# Altium project Project Power_Supply.PRJPCB
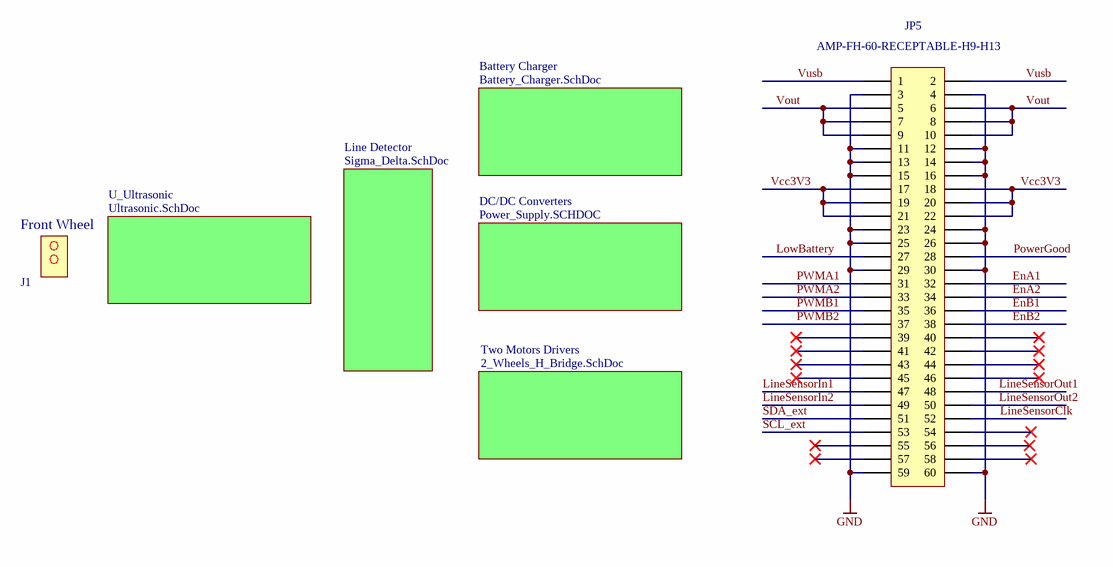
[diagram p0: Gecko3Power.SCHDOC]
6 sheets, 111 parts. Net scope: global (net labels, ports and power ports of the same name join across sheets).
Board files: Gecko3Power.PCBDOC, Gecko3Power_stencil.PCBDOC, Gecko3Power_panel.PCBDOC
Sheets:
  Gecko3Power.SCHDOC
    Two Motors Drivers = 2_Wheels_H_Bridge.SchDoc
    Line Detector = Sigma_Delta.SCHDOC
    U_Ultrasonic = Ultrasonic.SchDoc
    Battery Charger = Battery_Charger.SchDoc
    DC/DC Converters = Power_Supply.SCHDOC

## Sheet Gecko3Power.SCHDOC: Power Supply Board/ Robot Chassis
size A4; ApprovedBy: zac1; Author: mmb1; DrawnBy: mmb1; Engineer: mmb1; Organization: Berne University of Applied Sciences; Address1: School of Engineering and; Address2: Information Technology; Address3: Quellgasse 21; Address4: CH-2501 Biel; Revision: 1.0; SheetNumber: 1; SheetTotal: 6

### Parts
J1  fi  [Roue]  (value not drawn)
JP5  AMP-FH-60-RECEPTABLE-H9-H13  [amp_FH_.8mm_60pin_r_H9_H13]
  CC License  [CC-License]  (value not drawn)

### Sub-sheets
Battery Charger = Battery_Charger.SchDoc: no entries
DC/DC Converters = Power_Supply.SCHDOC: no entries
Line Detector = Sigma_Delta.SchDoc: no entries
Two Motors Drivers = 2_Wheels_H_Bridge.SchDoc: no entries
U_Ultrasonic = Ultrasonic.SchDoc: no entries

### Nets
GND: JP5.3 JP5.4 JP5.11 JP5.12 JP5.13 JP5.14 JP5.15 JP5.16 JP5.23 JP5.24 JP5.25 JP5.26 JP5.29 JP5.30 JP5.59 JP5.60
EnA1: JP5.32
EnA2: JP5.34
EnB1: JP5.36
EnB2: JP5.38
LineSensorClk: JP5.52
LineSensorIn1: JP5.47
LineSensorIn2: JP5.49
LineSensorOut1: JP5.48
LineSensorOut2: JP5.50
LowBattery: JP5.27
PowerGood: JP5.28
PWMA1: JP5.31
PWMA2: JP5.33
PWMB1: JP5.35
PWMB2: JP5.37
SCL_ext: JP5.53
SDA_ext: JP5.51
Vcc3V3: JP5.17 JP5.18 JP5.19 JP5.20 JP5.21 JP5.22
Vout: JP5.5 JP5.6 JP5.7 JP5.8 JP5.9 JP5.10
Vusb: JP5.1 JP5.2

Not connected (* = marked no-connect by the designer): JP5 39* 40* 41* 42* 43* 44* 45* 46* 54* 55* 56* 57* 58*

### Notes on the sheet
- Title:
- Size:
- Date:
- A4_L
- Author:
- Time:
- Revision:
- Sheet
- of
- File:
- (in symbol ROUE) Front Wheel

### Library data of the parts
J1 = ROUE
JP5 = AMP-FH-60-RECEPTABLE-H9-H13: AMP Free Height System, 0.8mm, 60 Pin, 9 or 13mm Height, Receptable; Part Number: 5-5179010-2; Value: fh-60r-13mm; Currency: CHF; Packaging unit: 1; Distributor: Farnell; Distributor Number: 1098 357; Manufacturer: AMP; RoHS: yes; Price: 3.85

## Sheet 2_Wheels_H_Bridge.SchDoc: H Bridge
size A4; ApprovedBy: zac1; Author: mmb1; DrawnBy: mmb1; Engineer: mmb1; Organization: Berne University of Applied Sciences; Address1: School of Engineering and; Address2: Information Technology; Address3: Quellgasse 21; Address4: CH-2501 Biel; Revision: 1.0; SheetNumber: 4; SheetTotal: 6
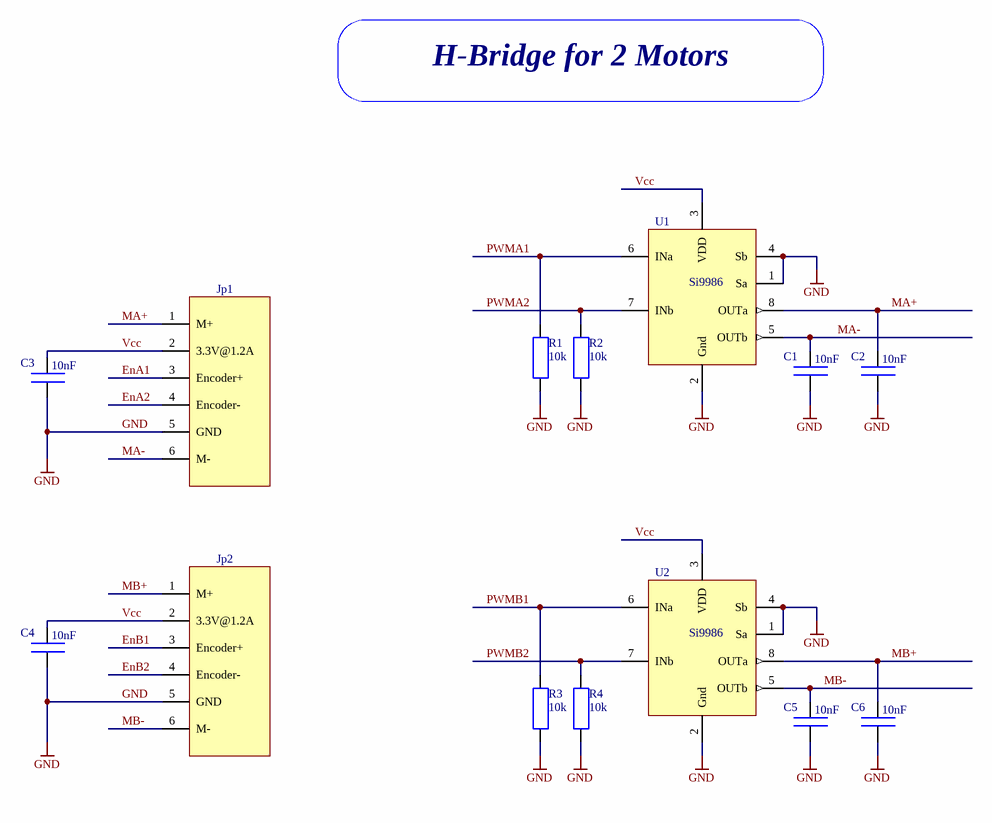
[diagram p1: 2_Wheels_H_Bridge.SchDoc]

### Parts
C1  10nF  [1608[0603]]
C2  10nF  [1608[0603]]
C3  10nF  [1608[0603]]
C4  10nF  [1608[0603]]
C5  10nF  [1608[0603]]
C6  10nF  [1608[0603]]
Jp1  (no value)  [New connector]
Jp2  (no value)  [New connector]
R1  10k  [1608[0603]]
R2  10k  [1608[0603]]
R3  10k  [1608[0603]]
R4  10k  [1608[0603]]
U1  Si9986  [Si9986]
U2  Si9986  [Si9986]

### Nets
GND: C1.1(J1) C2.1(J1) C3.1(J1) C4.1(J1) C5.1(J1) C6.1(J1) Jp1.5(GND) Jp2.5(GND) R1.1(J1) R2.1(J1) R3.1(J1) R4.1(J1) U1.1(Sa) U1.2(Gnd) U1.4(Sb) U2.1(Sa) U2.2(Gnd) U2.4(Sb)
EnA1: Jp1.3(Encoder+)
EnA2: Jp1.4(Encoder-)
EnB1: Jp2.3(Encoder+)
EnB2: Jp2.4(Encoder-)
MA+: C2.2(J2) Jp1.1(M+) U1.8(OUTa)
MA-: C1.2(J2) Jp1.6(M-) U1.5(OUTb)
MB+: C6.2(J2) Jp2.1(M+) U2.8(OUTa)
MB-: C5.2(J2) Jp2.6(M-) U2.5(OUTb)
PWMA1: R1.2(J2) U1.6(INa)
PWMA2: R2.2(J2) U1.7(INb)
PWMB1: R3.2(J2) U2.6(INa)
PWMB2: R4.2(J2) U2.7(INb)
Vcc: C3.2(J2) C4.2(J2) Jp1.2(3.3V@1.2A) Jp2.2(3.3V@1.2A) U1.3(VDD) U2.3(VDD)

### Notes on the sheet
- H-Bridge for 2 Motors
- Title:
- Size:
- Date:
- A4_L
- Author:
- Time:
- Revision:
- Sheet
- of
- File:

### Library data of the parts
C1-C6 = CAP: Capacitor; Manufacturer: AVX; Part Number: 06035C103KAT2A; Value: 10nF 0603; Currency: CHF; Packaging unit: 10; Part Type: 10nF; Distributor: Farnell; Distributor Number: 1327 675; Price: 0.07; RoHS: yes
Jp1 Jp2 = NEW CONNECTOR: Manufacturer: AMP; Part Number: 1241050-3; Value: Header 2x3,smt; Currency: CHF; Packaging unit: 1; Distributor: Farnell; Distributor Number: 9689 567; RoHS: yes; Price: 1.5
R1-R4 = RES: Resistance; Manufacturer: Multicomp; Part Number: MC 0.063W 0603 1% 10K; Value: 10k 0603; Currency: CHF; Packaging unit: 50; Part Type: 10k; Distributor: Farnell; Distributor Number: 9330 399; RoHS: X-yes; Price: 0.062
U1 U2 = Si9986: Manufacturer: Vishay; Part Number: SI9986DY-T1-E3; Currency: CHF; lead time: 2 Weeks; Packaging unit: 1; Value: Si9986; Distributor: Farnell; Distributor Number: 1199 224; RoHS: yes; Price: 6.6

## Sheet Sigma_Delta.SCHDOC: Line Detector Module (Sigma_Delta)
size A4; ApprovedBy: zac1; Author: mmb1; DrawnBy: mmb1; Engineer: mmb1; Organization: Berne University of Applied Sciences; Address1: School of Engineering and; Address2: Information Technology; Address3: Quellgasse 21; Address4: CH-2501 Biel; Revision: 1.0; SheetNumber: 5; SheetTotal: 6
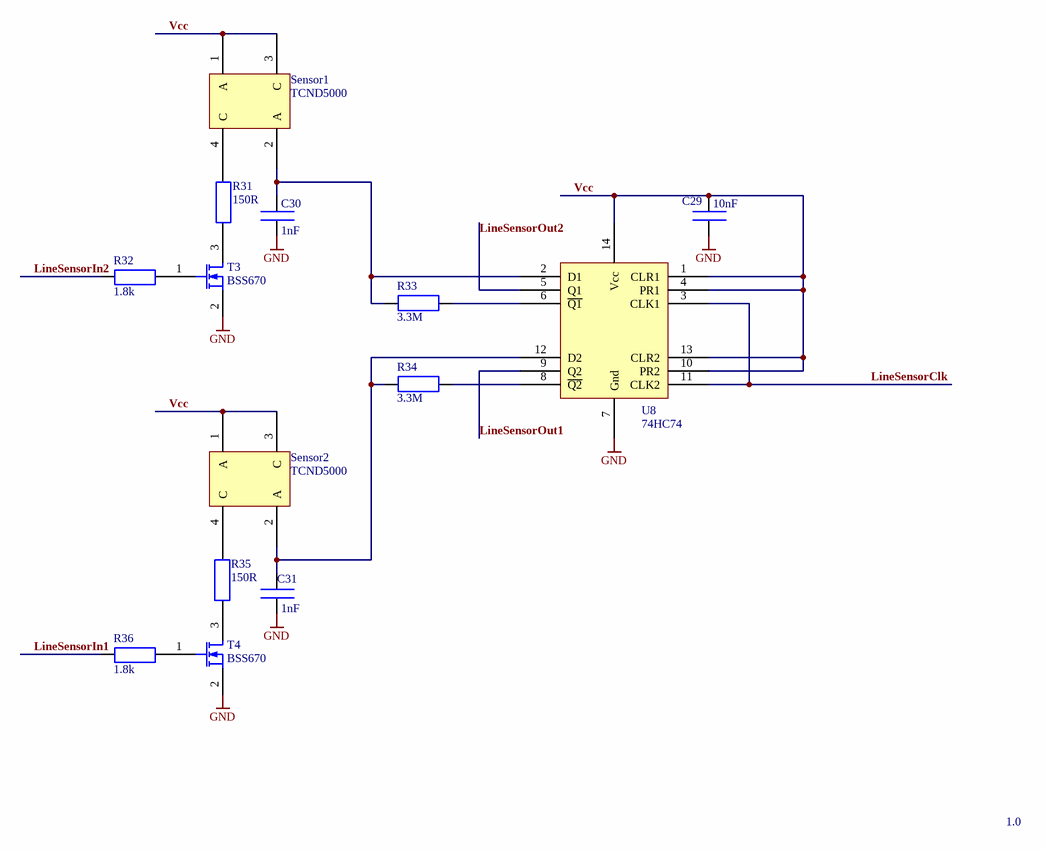
[diagram p2: Sigma_Delta.SCHDOC]

### Parts
C29  10nF  [1608[0603]]
C30  1nF  [1608[0603]]
C31  1nF  [1608[0603]]
R31  150R  [1608[0603]]
R32  1.8k  [1608[0603]]
R33  3.3M  [1608[0603]]
R34  3.3M  [1608[0603]]
R35  150R  [1608[0603]]
R36  1.8k  [1608[0603]]
Sensor1  TCND5000  [TCND5000]
Sensor2  TCND5000  [TCND5000]
T3  BSS670  [SOT-23]
T4  BSS670  [SOT-23]
U8  74HC74  [SO-G14]

### Nets
GND: C29.1(J1) C30.1(J1) C31.1(J1) T3.2(S) T4.2(S) U8.7(Gnd)
LineSensorClk: U8.3(CLK1) U8.11(CLK2)
LineSensorIn1: R36.1(J1)
LineSensorIn2: R32.1(J1)
LineSensorOut1: U8.9(Q2)
LineSensorOut2: U8.5(Q1)
Vcc: C29.2(J2) Sensor1.1(A) Sensor1.3(C) Sensor2.1(A) Sensor2.3(C) U8.1(CLR1) U8.4(PR1) U8.10(PR2) U8.13(CLR2) U8.14(Vcc)
NetC30_2: C30.2(J2) R33.2(J2) Sensor1.2(A) U8.2(D1)
NetC31_2: C31.2(J2) R34.2(J2) Sensor2.2(A) U8.12(D2)
NetR31_1: R31.1(J1) T3.3(D)
NetR31_2: R31.2(J2) Sensor1.4(C)
NetR32_2: R32.2(J2) T3.1(G)
NetR33_1: R33.1(J1) U8.6(~{Q1})
NetR34_1: R34.1(J1) U8.8(~{Q2})
NetR35_1: R35.1(J1) Sensor2.4(C)
NetR35_2: R35.2(J2) T4.3(D)
NetR36_2: R36.2(J2) T4.1(G)

### Notes on the sheet
- 1.0
- Title:
- Size:
- Date:
- A4_L
- Author:
- Time:
- Revision:
- Sheet
- of
- File:

### Library data of the parts
C29 = CAP: as C1 on sheet 2_Wheels_H_Bridge; Part Type: 10nF; Distributor: Farnell; Distributor Number: 1327 675; Price: 0.07; RoHS: yes
C30 C31 = CAP: Capacitor; Manufacturer: Murata; Part Number: GRM188R71H102KA01D; Value: 1nF 0603; Currency: CHF; Packaging unit: 10; Part Type: 1nF; Distributor: Farnell; Distributor Number: 8819 955; Price: 0.071; RoHS: yes
R31 R35 = RES: Resistance; Manufacturer: Multicomp; Part Number: MC 0.063W 0603 1% 150R; Value: 150R 0603; Currency: CHF; Packaging unit: 50; Part Type: 150R; Distributor: Farnell; Distributor Number: 9330 593; RoHS: X-yes; Price: 0.062
R32 R36 = RES: Resistance; Manufacturer: Multicomp; Part Number: MC 0.063W 0603 1% 1K8; Value: 1.8k 0603; Currency: CHF; Packaging unit: 50; Part Type: 1.8k; Distributor: Farnell; Distributor Number: 9330 712; Price: 0.062; RoHS: X-yes
R33 R34 = RES: Resistance; Manufacturer: PHYCOMP; Part Number: 232270463305; Value: 3.3M 0603; Currency: CHF; Packaging unit: 50; Part Type: 3.3M; Distributor: Farnell; Distributor Number: 9238 905; RoHS: yes; Price: 0.122
Sensor1 Sensor2 = TCND5000: Manufacturer: Vishay; Currency: CHF; lead time: 2 Weeks; Packaging unit: 1; Value: TCND5000; Distributor: Farnell; Distributor Number: 9169 997; Part Number: TCND5000; RoHS: yes; Price: 3.3
T3 T4 = MOSFET-N: Manufacturer: Infineon; Part Number: BSS670S2L; Currency: CHF; Packaging unit: 5; Value: BSS670; Distributor: Farnell; Distributor Number: 1095 673; Price: 0.35; RoHS: yes
U8 = 74HC74: Manufacturer: TI; Part Number: SN74HC74D; Value: 74HC74D; Currency: CHF; Packaging unit: 1; Distributor: Farnell; Distributor Number: 9591 680; RoHS: yes; Price: 0.632

## Sheet Ultrasonic.SchDoc: Ultrasonic Sensor
size A4; ApprovedBy: zac1; Author: mmb1; DrawnBy: mmb1; Engineer: mmb1; Organization: Berne University of Applied Sciences; Address1: School of Engineering and; Address2: Information Technology; Address3: Quellgasse 21; Address4: CH-2501 Biel; Revision: 1.0; SheetNumber: 6; SheetTotal: 6
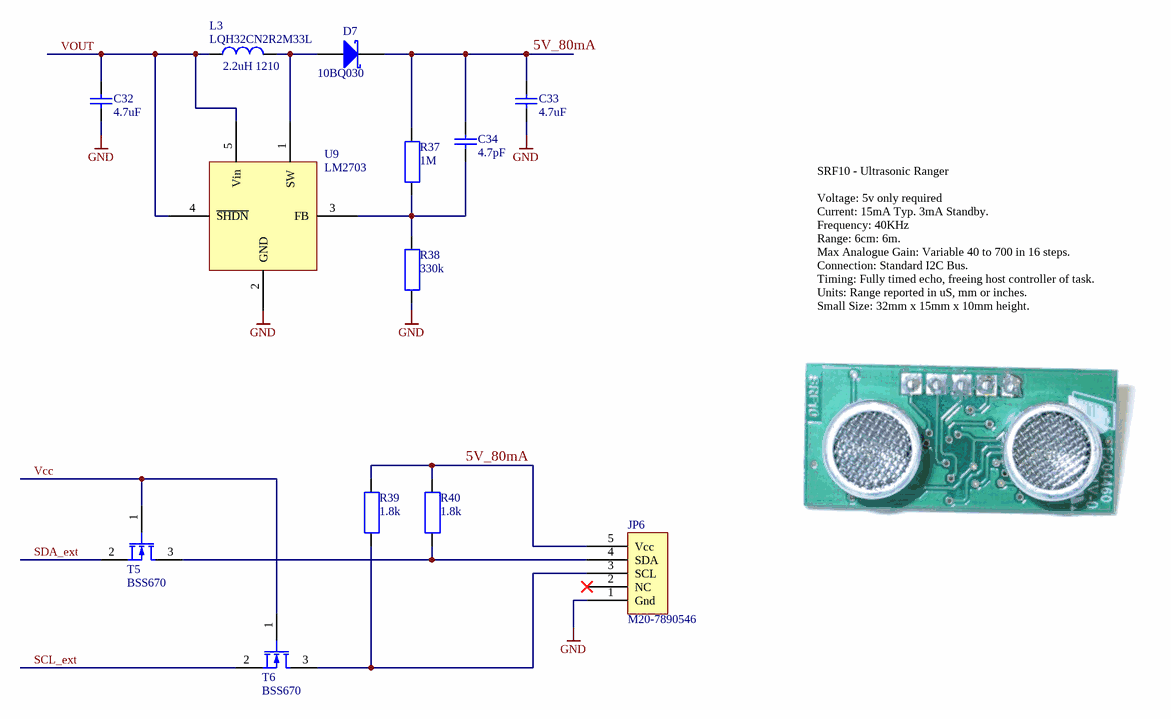
[diagram p3: Ultrasonic.SchDoc]

### Parts
C32  4.7uF  [C0805]
C33  4.7uF  [C0805]
C34  4.7pF  [C0805]
D7  10BQ030  [MBRS1100T3-D]
JP6  M20-7890546  [M20-7890546]
L3  value 2.2uH 1210  [CAPC1210L]  (hidden comment: LQH32CN2R2M33L)
R37  1M  [1608[0603]]
R38  330k  [1608[0603]]
R39  1.8k  [1608[0603]]
R40  1.8k  [1608[0603]]
T5  BSS670  [SOT-23]
T6  BSS670  [SOT-23]
U9  LM2703  [LM2703]

### Nets
GND: C32.1 C33.1 JP6.1(Gnd) R38.1(J1) U9.2(GND)
5V_80mA: C33.2 C34.2 D7.2(K) JP6.5(Vcc) R37.2(J2) R39.2(J2) R40.2(J2)
SCL_ext: T6.2(S)
SDA_ext: T5.2(S)
Vcc: T5.1(G) T6.1(G)
Vout: C32.2 L3.1(J1) U9.4(~{SHDN}) U9.5(Vin)
NetC34_1: C34.1 R37.1(J1) R38.2(J2) U9.3(FB)
NetD7_1: D7.1(A) L3.2(J2) U9.1(SW)
NetJP6_3: JP6.3(SCL) R39.1(J1) T6.3(D)
NetJP6_4: JP6.4(SDA) R40.1(J1) T5.3(D)

Not connected (* = marked no-connect by the designer): JP6 2(NC)*

### Notes on the sheet
- SRF10 - Ultrasonic Ranger
  Voltage: 5v only required
  Current: 15mA Typ. 3mA Standby.
  Frequency: 40KHz
  Range: 6cm: 6m.
  Max Analogue Gain: Variable 40 to 700 in 16 steps.
  Connection: Standard I2C Bus.
  Timing: Fully timed echo, freeing host controller of task.
  Units: Range reported in uS, mm or inches.
  Small Size: 32mm x 15mm x 10mm height.
- Title:
- Size:
- Date:
- A4_L
- Author:
- Time:
- Revision:
- Sheet
- of
- File:

### Library data of the parts
C32 C33 = Cap: Capacitor; Manufacturer: Kemet; Part Number: C0805C475K4PAC; Currency: CHF; Packaging unit: 10; Published: 8-Jun-2000; LatestRevisionDate: 17-Jul-2002; LatestRevisionNote: Re-released for DXP Platform.; Publisher: Altium Limited; Value: 4.7uF; Distributor: Farnell; Distributor Number: 9227 849; Price: 0.508; RoHS: yes
C34 = Cap: Capacitor; Manufacturer: AVX; Part Number: 06032U4R7CAT2A; Value: 4.7pF 0603; Currency: CHF; Packaging unit: 5; Published: 8-Jun-2000; LatestRevisionDate: 17-Jul-2002; LatestRevisionNote: Re-released for DXP Platform.; Publisher: Altium Limited; Distributor: Farnell; Distributor Number: 7568 258; Price: 0.45; RoHS: yes
D7 = D Schottky: Schottky Diode; Manufacturer: Vishay; Part Number: 10BQ030PBF; Currency: CHF; Packaging unit: 1; Value: 10BQ030; Distributor: Farnell; Distributor Number: 9100 687; Price: 0.42; RoHS: yes
JP6 = M20-7890546: Manufacturer: HARWIN; Currency: CHF; Packaging unit: 10; Value: M20-7890546; Distributor: Farnell; Distributor Number: 7992 076; Part Number: M20-7890546; RoHS: yes; Price: 1.45
L3 = COIL-LQH: Inductance; Manufacturer: Murata; Currency: CHF; Packaging unit: 5; Part Type: LQH32CN2R2M33L; Distributor: Farnell; Distributor Number: 9522 182; Part Number: LQH32CN2R2M33L; RoHS: yes; Price: 0.357
R37 = RES: Resistance; Manufacturer: Multicomp; Part Number: MC 0.063W 0603 1% 1M; Value: 1M 0603; Currency: CHF; Packaging unit: 50; Part Type: 1M; Distributor: Farnell; Distributor Number: 9330 410; RoHS: X-yes; Price: 0.062
R38 = RES: Resistance; Manufacturer: Multicomp; Part Number: MC 0.063W 0603 1% 330K; Value: 330k 0603; Currency: CHF; Packaging unit: 50; Part Type: 330k; Distributor: Farnell; Distributor Number: 9331 042; RoHS: X-yes; Price: 0.062
R39 R40 = RES: as R32 on sheet Sigma_Delta; Part Type: 1.8k; Distributor: Farnell; Distributor Number: 9330 712; RoHS: X-yes; Price: 0.062
T5 T6 = MOSFET-N: as T3 on sheet Sigma_Delta; Value: BSS670; Distributor: Farnell; Distributor Number: 1095 673; Price: 0.35; RoHS: yes
U9 = LM2703: Manufacturer: National; Part Number: LM2703MF-ADJ; Currency: CHF; Packaging unit: 1; Part Type: LM2703; Value: LM2703; Distributor: Farnell; Distributor Number: 9779 442; RoHS: yes; Price: 4

## Sheet Battery_Charger.SchDoc: Battery Charger
size A4; Author: zac1; DrawnBy: zac1; Engineer: zac1; Organization: Berne University of Applied Sciences; Address1: School of Engineering and; Address2: Information Technology; Address3: Quellgasse 21; Address4: CH-2501 Biel; Revision: 1.0; SheetNumber: 2; SheetTotal: 6
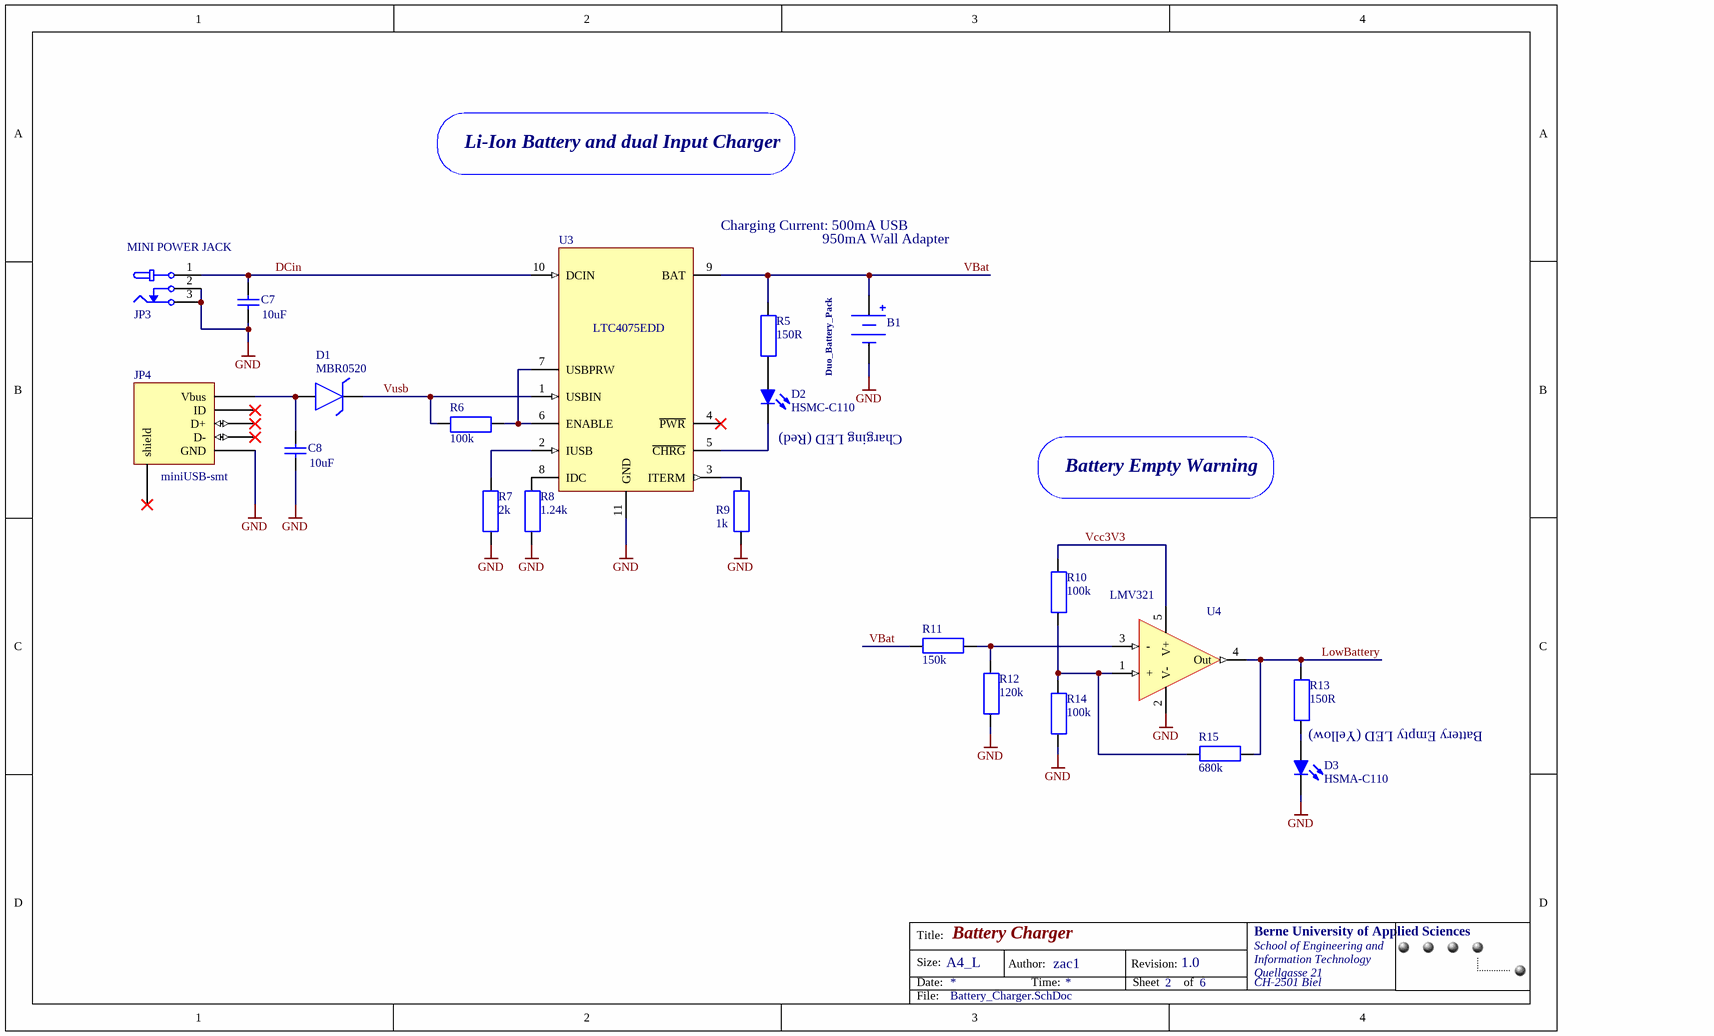
[diagram p4: Battery_Charger.SchDoc]

### Parts
B1  New_Battery  [Battery_new]  (value not drawn)
C7  value 10uF  [C1206]  (hidden comment: Cap Semi)
C8  value 10uF  [C1206]  (hidden comment: Cap Semi)
D1  MBR0520  [sod-123]
D2  HSMC-C110  [HSMC-C110]
D3  HSMA-C110  [HSMC-C110]
JP3  MINI POWER JACK  [Mini power Jack]
JP4  value miniUSB-smt  [USB_MINI_B_SMD]  (hidden comment: USB-MINIB-SMT)
R5  150R  [1608[0603]]
R6  100k  [1608[0603]]
R7  2k  [1608[0603]]
R8  1.24k  [1608[0603]]
R9  1k  [1608[0603]]
R10  100k  [1608[0603]]
R11  150k  [1608[0603]]
R12  120k  [1608[0603]]
R13  150R  [1608[0603]]
R14  100k  [1608[0603]]
R15  680k  [1608[0603]]
U3  LTC4075EDD  [LTC4075]
U4  LMV321  [LMV331]

### Nets
GND: B1.2(J2) C7.1 C8.1 D3.1(K) JP3.2(GND) JP3.3(GND) JP4.GND R7.2(J2) R8.1(J1) R9.1(J1) R12.1(J1) R14.1(J1) U3.11(GND) U4.2(V-)
DCin: C7.2 JP3.1(VDD) U3.10(DCIN)
LowBattery: R13.2(J2) R15.1(J1) U4.4(Out)
VBat: B1.1(J1) R5.2(J2) R11.2(J2) U3.9(BAT)
Vcc3V3: R10.2(J2) U4.5(V+)
Vusb: D1.1(Cathode) R6.1(J1) U3.1(USBIN)
NetC8_2: C8.2 D1.2(Anode) JP4.Vbus
NetD2_1: D2.1(K) U3.5(~{CHRG})
NetD2_2: D2.2(A) R5.1(J1)
NetD3_2: D3.2(A) R13.1(J1)
NetR6_2: R6.2(J2) U3.6(ENABLE) U3.7(USBPRW)
NetR7_1: R7.1(J1) U3.2(IUSB)
NetR8_2: R8.2(J2) U3.8(IDC)
NetR9_2: R9.2(J2) U3.3(ITERM)
NetR10_1: R10.1(J1) R14.2(J2) R15.2(J2) U4.1(+)
NetR11_1: R11.1(J1) R12.2(J2) U4.3(-)

Not connected (* = marked no-connect by the designer): JP4 D+* D-* ID* shield*; U3 4(~{PWR})*

### Notes on the sheet
- Li-Ion Battery and dual Input Charger
- (near U3) Charging Current: 500mA USB
- 950mA Wall Adapter
- (near B1) Duo_Battery_Pack
- (near D2) Charging LED (Red)
- Battery Empty Warning
- (near R13) Battery Empty LED (Yellow)
- Title:
- Size:
- Date:
- A4_L
- Author:
- Time:
- Revision:
- Sheet
- of
- File:

### Library data of the parts
B1 = BATTERY_NEW: Manufacturer: Contrel; Value: PA-LP987; Currency: CHF; lead time: 5 Weeks; Packaging unit: 1; Distributor: Contrel; Distributor Number: PA-LP987; Part Number: PA-LP987; RoHS: yes
C7 C8 = Cap Semi: Capacitor (Semiconductor SIM Model); Manufacturer: Murata; Part Number: GRM31CR70J106KA01L; Currency: CHF; Packaging unit: 1; Published: 8-Jun-2000; LatestRevisionDate: 17-Jul-2002; LatestRevisionNote: Re-released for DXP Platform.; Publisher: Altium Limited; Distributor: Farnell; Distributor Number: 9527 729; Price: 0.25; RoHS: yes
D1 = SCHOTTKY_MBR05*: Manufacturer: ON Semi; Part Number: MBR0520LT1G; Currency: CHF; Packaging unit: 1; Part Type: MBR0520; Value: MBR0520; Distributor: Farnell; Distributor Number: 9556 915; Price: 0.561; RoHS: yes
D2 = LED-HSM*-C110: LED; Manufacturer: Avago; Value: side led red; Currency: CHF; Packaging unit: 5; Revision: July-2002: Re-released for DXP Platform.; Part Type: HSMC-C110; Distributor: Farnell; Distributor Number: 8554 498; Part Number: HSMC-C110; Price: 0.288; RoHS: yes
D3 = LED-HSM*-C110: LED; Manufacturer: Avago; Value: side led yellow; Currency: CHF; Packaging unit: 5; Revision: July-2002: Re-released for DXP Platform.; Part Type: HSMA-C110; Distributor: Farnell; Distributor Number: 8554 455; Part Number: HSMA-C110; Price: 0.577; RoHS: yes
JP3 = MINI POWER JACK: Manufacturer: CLIFF ELECTRONIC; Value: DC8; Currency: CHF; Packaging unit: 10; Distributor: Farnell; Distributor Number: 224 947; Part Number: DC8; RoHS: yes; Price: 1.855
JP4 = USB-MINIB-SMT: Manufacturer: Lumberg; Part Number: 2486 01; Currency: CHF; Packaging unit: 1; Distributor: Farnell; Distributor Number: 1243 250; RoHS: yes; Price: 2.55
R5 R13 = RES: as R31 on sheet Sigma_Delta; Part Type: 150R; Distributor: Farnell; Distributor Number: 9330 593; RoHS: X-yes; Price: 0.062
R6 R10 R14 = RES: Resistance; Manufacturer: Multicomp; Part Number: MC 0.063W 0603 1% 100K; Value: 100k 0603; Currency: CHF; Packaging unit: 50; Part Type: 100k; Distributor: Farnell; Distributor Number: 9330 402; RoHS: X-yes; Price: 0.062
R7 = RES: Resistance; Manufacturer: Multicomp; Part Number: MC 0.063W 0603 1% 2K; Value: 2k 0603; Currency: CHF; Packaging unit: 50; Part Type: 2k; Distributor: Farnell; Distributor Number: 9330 763; RoHS: X-yes; Price: 0.062
R8 = RES: as R37 on sheet Ultrasonic; Part Type: 1.24k; Distributor: Farnell; Distributor Number: 9330 410; RoHS: X-yes; Price: 0.062
R9 = RES: Resistance; Manufacturer: Multicomp; Part Number: MC 0.063W 0603 1% 1K; Value: 1k 0603; Currency: CHF; Packaging unit: 50; Part Type: 1k; Distributor: Farnell; Distributor Number: 9330 380; RoHS: X-yes; Price: 0.062
R11 = RES: Resistance; Manufacturer: Multicomp; Part Number: MC 0.063W 0603 1% 150K; Value: 150k 0603; Currency: CHF; Packaging unit: 50; Part Type: 150k; Distributor: Farnell; Distributor Number: 9330 623; RoHS: X-yes; Price: 0.034
R12 = RES: Resistance; Manufacturer: Multicomp; Part Number: MC 0.063W 0603 1% 120K; Value: 120k 0603; Currency: CHF; Packaging unit: 50; Part Type: 120k; Distributor: Farnell; Distributor Number: 9330 526; RoHS: X-yes; Price: 0.062
R15 = RES: Resistance; Manufacturer: Multicomp; Part Number: MC 0.063W 0603 1% 680K; Value: 680k 0603; Currency: CHF; Packaging unit: 50; Part Type: 680k; Distributor: Farnell; Distributor Number: 9331 476; RoHS: X-yes; Price: 0.062
U3 = LTC4075: Manufacturer: Linear; Part Number: LTC4075EDD#PBF; Currency: $; lead time: 2 Weeks; Packaging unit: 1; Value: LTC4075; Distributor: Linear online; Distributor Number: LTC4075EDD#PBF; RoHS: yes; Price: 2.67
U4 = LMV321: Op. Amp.; Manufacturer: TI; Value: LMV321IDBVR; Currency: CHF; Packaging unit: 1; Distributor: Farnell; Distributor Number: 1105 935; Part Number: LMV321IDBVR; RoHS: yes; Price: 0.863

## Sheet Power_Supply.SCHDOC: Power Supply
size A3; ApprovedBy: zac1; Author: mmb1; DrawnBy: mmb1; Engineer: mmb1; Organization: Berne University of Applied Sciences; Address1: School of Engineering and; Address2: Information Technology; Address3: Quellgasse 21; Address4: CH-2501 Biel; Revision: 1.0; SheetNumber: 3; SheetTotal: 6
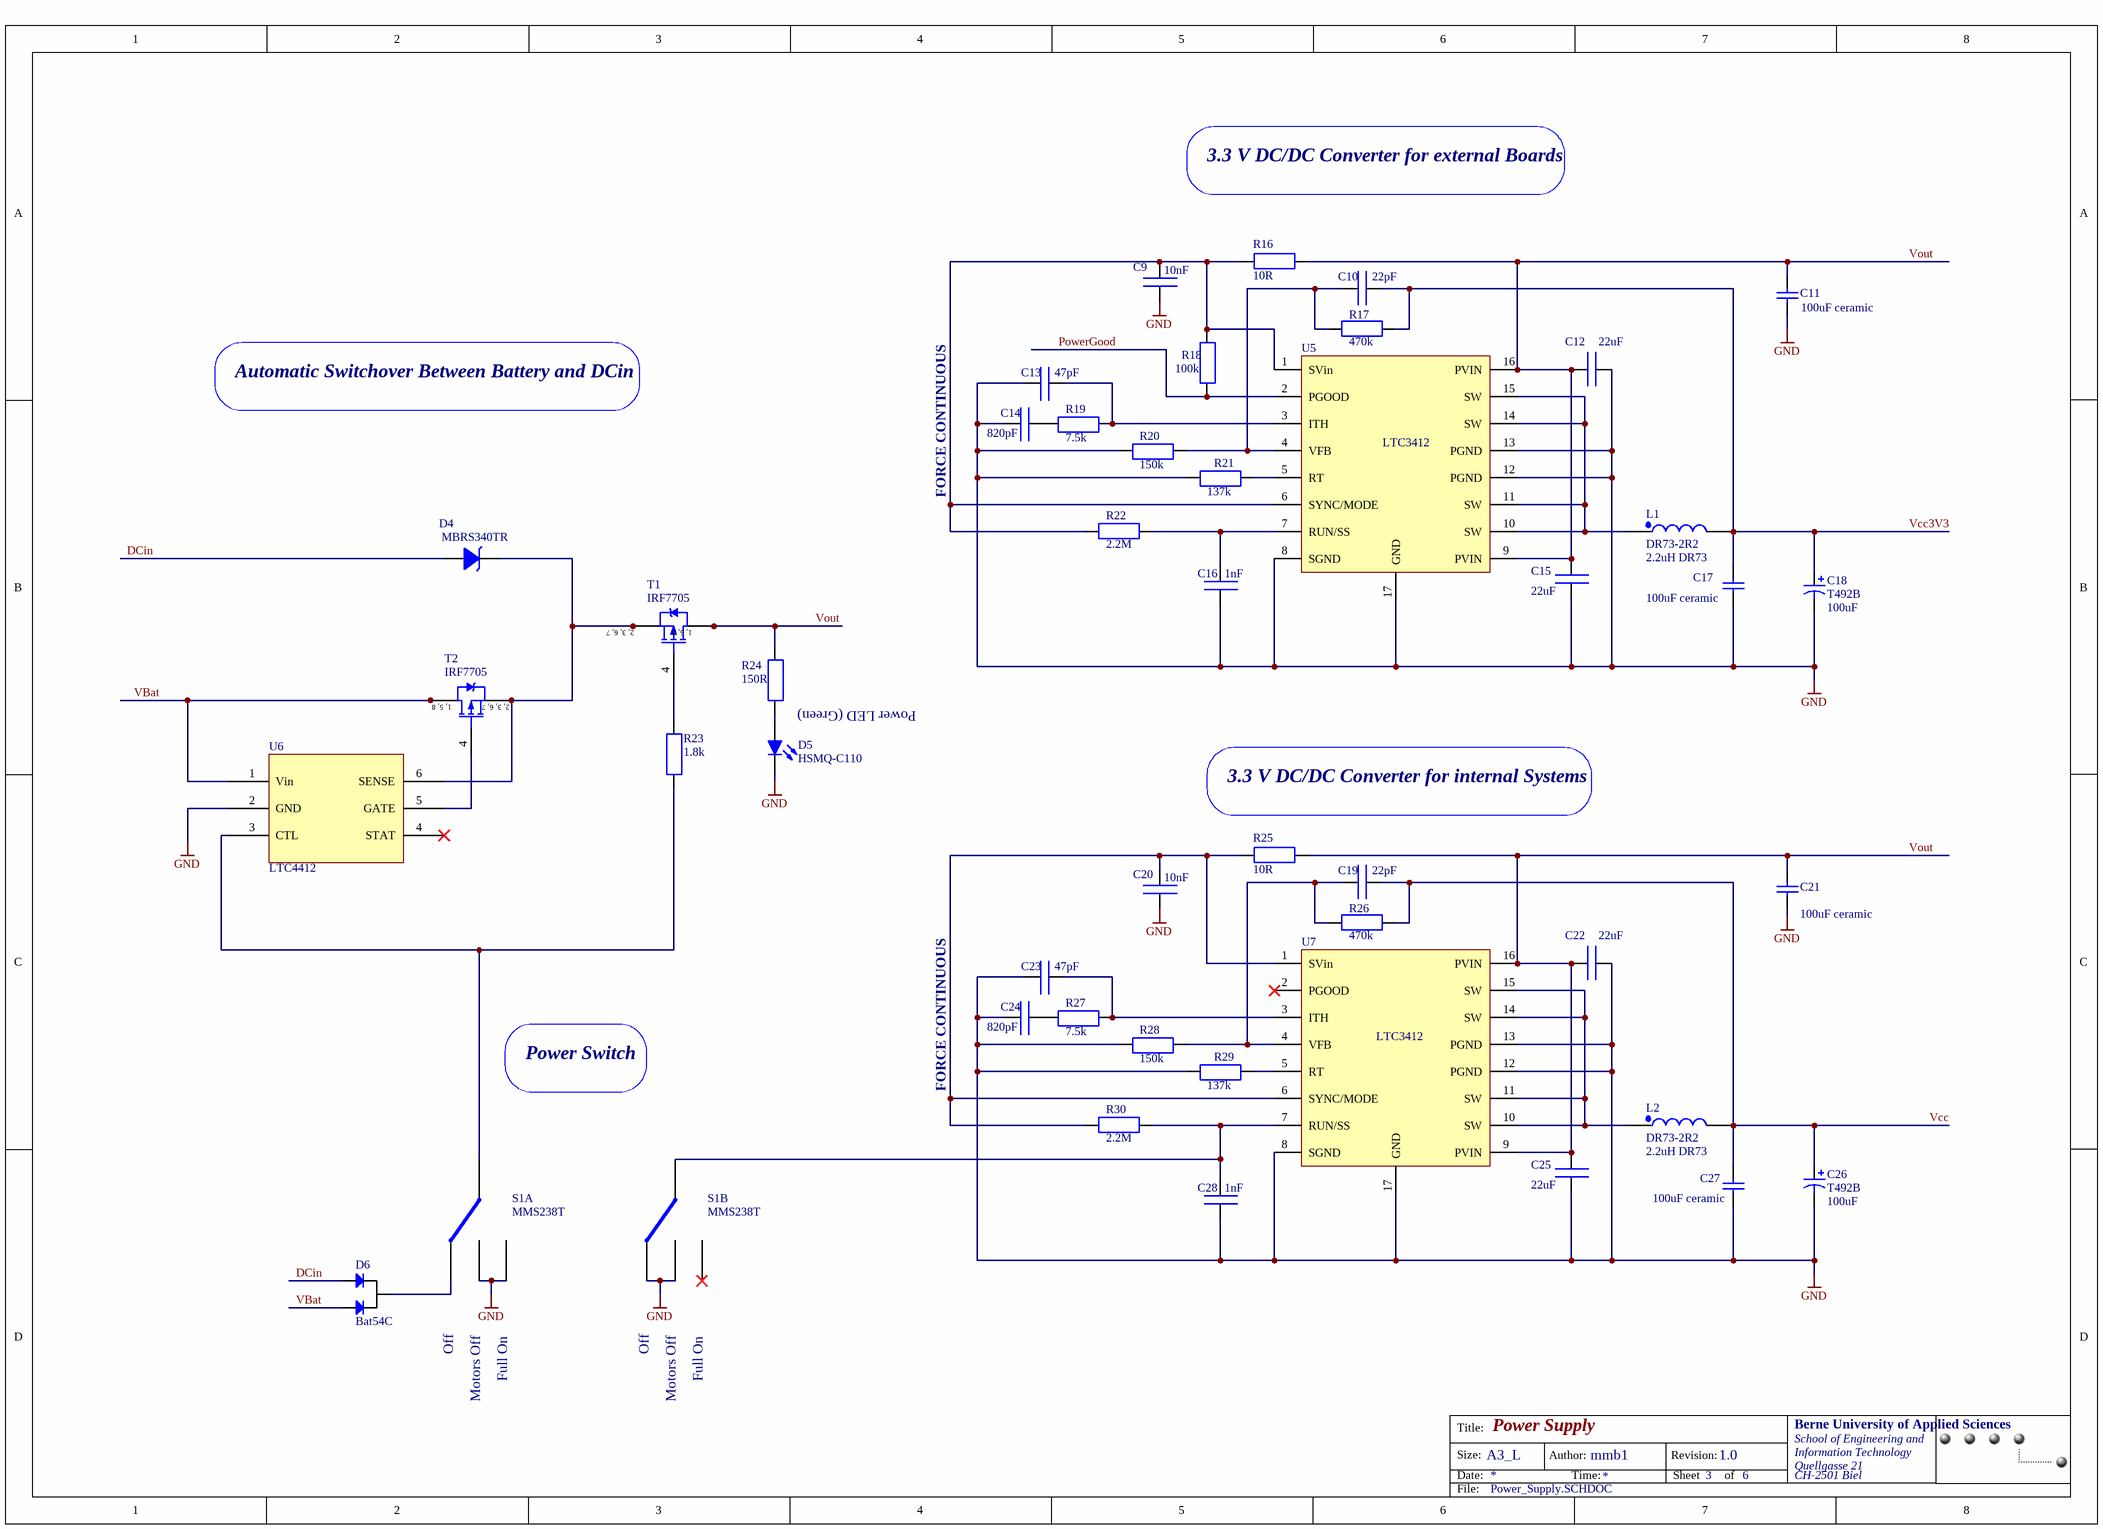
[diagram p5: Power_Supply.SCHDOC]

### Parts
C9  10nF  [1608[0603]]
C10  22pF  [1608[0603]]
C11  value 100uF ceramic  [C1210]  (hidden comment: Cap Semi)
C12  22uF  [C0805]
C13  47pF  [1608[0603]]
C14  820pF  [1608[0603]]
C15  22uF  [C0805]
C16  1nF  [1608[0603]]
C17  value 100uF ceramic  [C1210]  (hidden comment: Cap Semi)
C18  T492B  value 100uF  [B]
C19  22pF  [1608[0603]]
C20  10nF  [1608[0603]]
C21  value 100uF ceramic  [C1210]  (hidden comment: Cap Semi)
C22  22uF  [C0805]
C23  47pF  [1608[0603]]
C24  820pF  [1608[0603]]
C25  22uF  [C0805]
C26  T492B  value 100uF  [B]
C27  value 100uF ceramic  [C1210]  (hidden comment: Cap Semi)
C28  1nF  [1608[0603]]
D4  value MBRS340TR  [MBRS340]  (hidden comment: Schottky  Power Rectifier)
D5  HSMQ-C110  [HSMC-C110]
D6  Bat54C  [BAT54C]
L1  value 2.2uH DR73  [B82472G4222M]  (hidden comment: DR73-2R2)
L2  value 2.2uH DR73  [B82472G4222M]  (hidden comment: DR73-2R2)
R16  10R  [1608[0603]]
R17  470k  [1608[0603]]
R18  100k  [1608[0603]]
R19  7.5k  [1608[0603]]
R20  150k  [1608[0603]]
R21  137k  [1608[0603]]
R22  2.2M  [1608[0603]]
R23  1.8k  [1608[0603]]
R24  150R  [1608[0603]]
R25  10R  [1608[0603]]
R26  470k  [1608[0603]]
R27  7.5k  [1608[0603]]
R28  150k  [1608[0603]]
R29  137k  [1608[0603]]
R30  2.2M  [1608[0603]]
S1  MMS238T  [switch_mms238t]  (parts A,B of 2)
T1  IRF7705  [TSSOP-8]
T2  IRF7705  [TSSOP-8]
U5  LTC3412  [LCT3412A_New]
U6  LTC4412  [MAX5467]
U7  LTC3412  [LCT3412A_New]

### Nets
GND: C9.1(J1) C11.1 C12.1(J1) C13.1(J1) C14.1(J1) C15.1(J1) C16.1(J1) C17.1 C18.2 C20.1(J1) C21.1 C22.1(J1) C23.1(J1) C24.1(J1) C25.1(J1) C26.2 C27.1 C28.1(J1) D5.1(K) R20.1(J1) R21.1(J1) R28.1(J1) R29.1(J1) S1.3 S1.4 S1.6 S1.8 U5.8(SGND) U5.12(PGND) U5.13(PGND) U5.17(GND) U6.2(GND) U7.8(SGND) U7.12(PGND) U7.13(PGND) U7.17(GND)
DCin: D4.1(Anode) D6.2(A)
PowerGood: R18.1(J1) U5.2(PGOOD)
VBat: D6.1(A) T2.1(D) T2.5(D) T2.8(D) U6.1(Vin)
Vcc: C19.1(J1) C26.1 C27.2 L2.2 R26.1(J1)
Vcc3V3: C10.1(J1) C17.2 C18.1 L1.2 R17.1(J1)
Vout: C11.2 C12.2(J2) C15.2(J2) C21.2 C22.2(J2) C25.2(J2) R16.1(J1) R24.2(J2) R25.1(J1) T1.1(D) T1.5(D) T1.8(D) U5.9(PVIN) U5.16(PVIN) U7.9(PVIN) U7.16(PVIN)
NetC9_2: C9.2(J2) R16.2(J2) R18.2(J2) R22.2(J2) U5.1(SVin) U5.6(SYNC/MODE)
NetC10_2: C10.2(J2) R17.2(J2) R20.2(J2) U5.4(VFB)
NetC13_2: C13.2(J2) R19.2(J2) U5.3(ITH)
NetC14_2: C14.2(J2) R19.1(J1)
NetC16_2: C16.2(J2) R22.1(J1) U5.7(RUN/SS)
NetC19_2: C19.2(J2) R26.2(J2) R28.2(J2) U7.4(VFB)
NetC20_2: C20.2(J2) R25.2(J2) R30.2(J2) U7.1(SVin) U7.6(SYNC/MODE)
NetC23_2: C23.2(J2) R27.2(J2) U7.3(ITH)
NetC24_2: C24.2(J2) R27.1(J1)
NetC28_2: C28.2(J2) R30.1(J1) S1.7 U7.7(RUN/SS)
NetD4_2: D4.2(Cathode) T1.2(S) T1.3(S) T1.6(S) T1.7(S) T2.2(S) T2.3(S) T2.6(S) T2.7(S) U6.6(SENSE)
NetD5_2: D5.2(A) R24.1(J1)
NetD6_3: D6.3(K) S1.1
NetL1_1: L1.1 U5.10(SW) U5.11(SW) U5.14(SW) U5.15(SW)
NetL2_1: L2.1 U7.10(SW) U7.11(SW) U7.14(SW) U7.15(SW)
NetR21_2: R21.2(J2) U5.5(RT)
NetR23_1: R23.1(J1) S1.2 U6.3(CTL)
NetR23_2: R23.2(J2) T1.4(G)
NetR29_2: R29.2(J2) U7.5(RT)
NetT2_4: T2.4(G) U6.5(GATE)

Not connected (* = marked no-connect by the designer): S1 5*; U6 4(STAT)*; U7 2(PGOOD)*

### Notes on the sheet
- 3.3 V DC/DC Converter for external Boards
- Automatic Switchover Between Battery and DCin
- FORCE CONTINUOUS
- Power LED (Green)
- 3.3 V DC/DC Converter for internal Systems
- Power Switch
- Off
- Motors Off
- Full On
- Title:
- Size:
- Date:
- A3_L
- Author:
- Time:
- Revision:
- Sheet
- of
- File:
- (in symbol IRF7705) 1, 5, 8; 2, 3, 6, 7

### Library data of the parts
C9 C20 = CAP: as C1 on sheet 2_Wheels_H_Bridge; Part Type: 10nF; Distributor: Farnell; Distributor Number: 1327 675; Price: 0.07; RoHS: yes
C10 C19 = CAP: Capacitor; Manufacturer: Epcos; Part Number: B37930K5220J60; Value: 22pF 0603; Currency: CHF; Packaging unit: 10; Part Type: 22pF; Distributor: Farnell; Distributor Number: 9753 486; Price: 0.083; RoHS: yes
C11 C17 C21 C27 = Cap Semi: Capacitor (Semiconductor SIM Model); Manufacturer: Kemet; Part Number: C1210C107M9PAC7800; Currency: CHF; Packaging unit: 1; Published: 8-Jun-2000; LatestRevisionDate: 17-Jul-2002; LatestRevisionNote: Re-released for DXP Platform.; Publisher: Altium Limited; Distributor: Farnell; Distributor Number: 1108 328; Price: 4.13; RoHS: yes
C12 C15 C22 C25 = CAP: Capacitor; Manufacturer: Kemet; Part Number: C0805C226M9PAC7800; Value: 22uF 0805; Currency: CHF; Packaging unit: 1; Distributor: Farnell; Distributor Number: 1108 326; Price: 1.8; RoHS: yes
C13 C23 = CAP: Capacitor; Manufacturer: Murata; Part Number: GRM1885C1H470JA01D; Value: 47pF 0603; Currency: CHF; Packaging unit: 10; Part Type: 47pF; Distributor: Farnell; Distributor Number: 8819 840; Price: 0.071; RoHS: yes
C14 C24 = CAP: Capacitor; Manufacturer: PHYCOMP; Part Number: 2238 861 15821; Value: 820pF 0603; Currency: CHF; Packaging unit: 10; Part Type: 820pF; Distributor: Farnell; Distributor Number: 718 555; Price: 0.115; RoHS: yes
C16 C28 = CAP: as C30 on sheet Sigma_Delta; Part Type: 1nF; Distributor: Farnell; Distributor Number: 8819 955; Price: 0.071; RoHS: yes
C18 C26 = T492B: Solid Tantalum Chip Capacitor, T492 Series - CWR11 Style Per Mil-PRF-55365/8; Manufacturer: AVX; Part Number: TCJB107M004R0070; Currency: CHF; Packaging unit: 1; Published: 17-Jul-2002; LatestRevisionDate: 19-Mar-2004; LatestRevisionNote: Silkscreen dimensions re-sized.; Publisher: Altium Limited; Distributor: Farnell; Distributor Number: 1135 228; Price: 0.98; RoHS: yes
D4 = shottky-mbrs340tr: Manufacturer: Vishay; Part Number: MBRS340TRPBF; Currency: CHF; Packaging unit: 1; Distributer: Farnell; Part Type: Schottky  Power Rectifier; Distributor: Farnell; Distributor Number: 1463 234; Price: 0.617; RoHS: yes
D5 = LED-HSM*-C110: LED; Manufacturer: Avago; Value: side led green; Currency: CHF; Packaging unit: 5; Revision: July-2002: Re-released for DXP Platform.; Part Type: HSMQ-C110; Distributor: Farnell; Distributor Number: 8554 692; Part Number: HSMQ-C110; Price: 1.8; RoHS: yes
D6 = BAT54C: Manufacturer: ST; Part Number: BAT54CFILM; Currency: CHF; lead time: 2 Weeks; Packaging unit: 1; Part Type: Bat54C; Value: BAT54C; Distributor: Farnell; Distributor Number: 1261 334; Price: 0.13; RoHS: yes
L1 L2 = COIL-DR-SERIE: DR Series Coils from Coiltronics; Manufacturer: Cooper Bussmann; Currency: CHF; Packaging unit: 1; Part Type: DR73-2R2; Distributor: Farnell; Distributor Number: 1463 507; Part Number: DR73-2R2; RoHS: yes; Price: 2
R16 R25 = RES: Resistance; Manufacturer: Multicomp; Part Number: MC 0.063W 0603 1% 10R; Value: 10R 0603; Currency: CHF; Packaging unit: 50; Part Type: 10R; Distributor: Farnell; Distributor Number: 9330 429; RoHS: X-yes; Price: 0.062
R17 R26 = RES: Resistance; Manufacturer: Multicomp; Part Number: MC 0.063W 0603 1% 470K; Value: 470k 0603; Currency: CHF; Packaging unit: 50; Part Type: 470k; Distributor: Farnell; Distributor Number: 9331 263; RoHS: X-yes; Price: 0.034
R18 = RES: as R6 on sheet Battery_Charger; Part Type: 100k; Distributor: Farnell; Distributor Number: 9330 402; RoHS: X-yes; Price: 0.062
R19 R27 = RES: Resistance; Manufacturer: Multicomp; Part Number: MC 0.063W 0603 1% 7K5; Value: 7.5k 0603; Currency: CHF; Packaging unit: 50; Part Type: 7.5k; Distributor: Farnell; Distributor Number: 9331 514; RoHS: X-yes; Price: 0.062
R20 R28 = RES: as R11 on sheet Battery_Charger; Part Type: 150k; Distributor: Farnell; Distributor Number: 9330 623; RoHS: X-yes; Price: 0.034
R21 R29 = RES: Resistance; Manufacturer: Multicomp; Part Number: MC 0.063W 0603 1% 137K; Value: 137k 0603; Currency: CHF; Packaging unit: 50; Part Type: 137k; Distributor: Farnell; Distributor Number: 1170 999; RoHS: X-yes; Price: 0.034
R22 R30 = RES: Resistance; Manufacturer: PHYCOMP; Part Number: 232270462205; Value: 2.2M 0603; Currency: CHF; Packaging unit: 50; Part Type: 2.2M; Distributor: Farnell; Distributor Number: 9238 883; RoHS: yes; Price: 0.122
R23 = RES: as R32 on sheet Sigma_Delta; Part Type: 1.8k; Distributor: Farnell; Distributor Number: 9330 712; Price: 0.062; RoHS: X-yes
R24 = RES: as R31 on sheet Sigma_Delta; Part Type: 150R; Distributor: Farnell; Distributor Number: 9330 593; RoHS: X-yes; Price: 0.062
S1 = switch-mms238T: Manufacturer: KNITTER; Currency: CHF; Packaging unit: 1; Part Type: MMS238T; Value: MMS 238 T; Distributor: Farnell; Distributor Number: 8546 827; Part Number: MMS 238 T; RoHS: yes; Price: 3.35
T1 T2 = IRF7705: HEXFET Power MOSFET; Manufacturer: IRF; Part Number: IRF7705TRPBF; Currency: CHF; Packaging unit: 1; Published: 17-Sep-2003; LatestRevisionDate: 04-Mar-2005; LatestRevisionNote: Stylized 3D Model Added.; DatasheetVersion: 5-Jun-2001; PackageVersion: Jun-2000; Publisher: Altium Limited; PackageDescription: Shrink Small Outline; 8 Leads; Body Width 4.4 mm; Pitch 0.65 mm; Value: IRF7705; Distributor: Farnell; Distributor Number: 1298 533; Price: 3.65; RoHS: yes
U5 U7 = LTC3412A_NEW: Manufacturer: Linear; Part Number: LTC3412AEFE#PBF; Value: LTC3412AEFE; Currency: $; lead time: 2 Weeks; Packaging unit: 2; Distributor: Linear online; Distributor Number: LTC3412AEFE#PBF; RoHS: yes; Price: 4.93
U6 = LTC4412: Manufacturer: Linear; Part Number: LTC4412ES6#PBF; Currency: $; lead time: 2 Weeks; Packaging unit: 2; Value: LTC4412; Distributor: Linear online; Distributor Number: LTC4412ES6#PBF; RoHS: yes; Price: 1.93

## Nets that join several sheets
GND: Gecko3Power (16 pins), 2_Wheels_H_Bridge (18 pins), Sigma_Delta (6 pins), Ultrasonic (5 pins), Battery_Charger (14 pins), Power_Supply (36 pins)
DCin: Battery_Charger (C7.2 JP3.1 U3.10), Power_Supply (D4.1 D6.2)
EnA1: Gecko3Power (JP5.32), 2_Wheels_H_Bridge (Jp1.3)
EnA2: Gecko3Power (JP5.34), 2_Wheels_H_Bridge (Jp1.4)
EnB1: Gecko3Power (JP5.36), 2_Wheels_H_Bridge (Jp2.3)
EnB2: Gecko3Power (JP5.38), 2_Wheels_H_Bridge (Jp2.4)
LineSensorClk: Gecko3Power (JP5.52), Sigma_Delta (U8.3 U8.11)
LineSensorIn1: Gecko3Power (JP5.47), Sigma_Delta (R36.1)
LineSensorIn2: Gecko3Power (JP5.49), Sigma_Delta (R32.1)
LineSensorOut1: Gecko3Power (JP5.48), Sigma_Delta (U8.9)
LineSensorOut2: Gecko3Power (JP5.50), Sigma_Delta (U8.5)
LowBattery: Gecko3Power (JP5.27), Battery_Charger (R13.2 R15.1 U4.4)
PowerGood: Gecko3Power (JP5.28), Power_Supply (R18.1 U5.2)
PWMA1: Gecko3Power (JP5.31), 2_Wheels_H_Bridge (R1.2 U1.6)
PWMA2: Gecko3Power (JP5.33), 2_Wheels_H_Bridge (R2.2 U1.7)
PWMB1: Gecko3Power (JP5.35), 2_Wheels_H_Bridge (R3.2 U2.6)
PWMB2: Gecko3Power (JP5.37), 2_Wheels_H_Bridge (R4.2 U2.7)
SCL_ext: Gecko3Power (JP5.53), Ultrasonic (T6.2)
SDA_ext: Gecko3Power (JP5.51), Ultrasonic (T5.2)
VBat: Battery_Charger (B1.1 R5.2 R11.2 U3.9), Power_Supply (5 pins)
Vcc: 2_Wheels_H_Bridge (6 pins), Sigma_Delta (10 pins), Ultrasonic (T5.1 T6.1), Power_Supply (5 pins)
Vcc3V3: Gecko3Power (6 pins), Battery_Charger (R10.2 U4.5), Power_Supply (5 pins)
Vout: Gecko3Power (6 pins), Ultrasonic (C32.2 L3.1 U9.4 U9.5), Power_Supply (16 pins)
Vusb: Gecko3Power (JP5.1 JP5.2), Battery_Charger (D1.1 R6.1 U3.1)